# EAGLE design I2C-SignalTestJig (EAGLE 7.7.0)
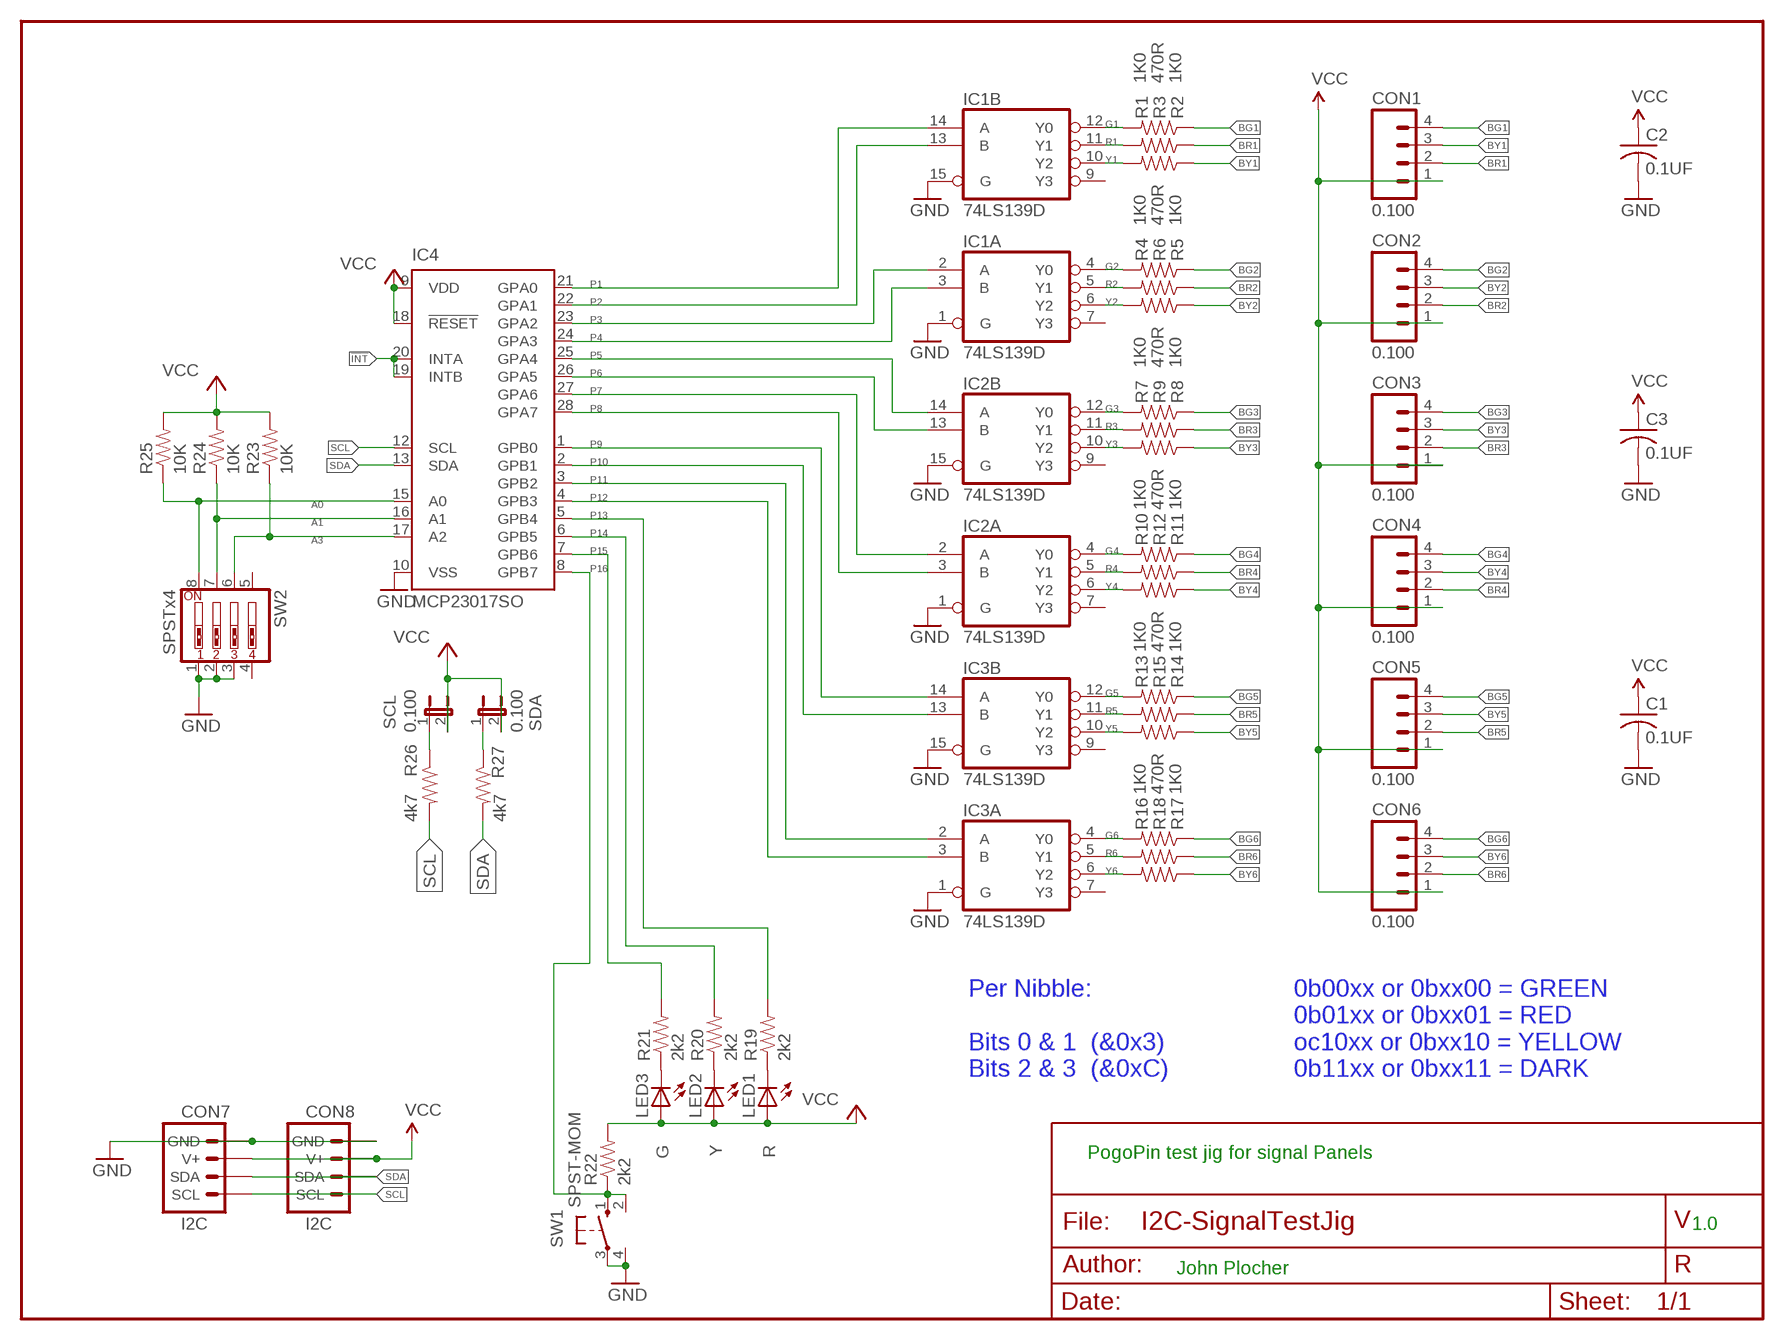
[diagram p0: schematic, sheet 1]

## Parts
C1  0.1UF  CAP0603  [0603-CAP]
C2  0.1UF  CAP0603  [0603-CAP]
C3  0.1UF  CAP0603  [0603-CAP]
CON1  0.100  CONNECTOR-M04LOCK  [1X04_LOCK]
CON2  0.100  CONNECTOR-M04LOCK  [1X04_LOCK]
CON3  0.100  CONNECTOR-M04LOCK  [1X04_LOCK]
CON4  0.100  CONNECTOR-M04LOCK  [1X04_LOCK]
CON5  0.100  CONNECTOR-M04LOCK  [1X04_LOCK]
CON6  0.100  CONNECTOR-M04LOCK  [1X04_LOCK]
CON7  I2C  CONNECTOR-I2CLEFT  [I2C-L]
CON8  I2C  CONNECTOR-I2CLEFT  [I2C-L]
IC1  74LS139D  [SO16]
IC2  74LS139D  [SO16]
IC3  74LS139D  [SO16]
IC4  MCP23017SO  [SO28W]
LED1  R  LED0603-LED  [0603-LED]
LED2  Y  LED0603-LED  [0603-LED]
LED3  G  LED0603-LED  [0603-LED]
R1  1K0  R0805-RES  [0805-RES]
R2  1K0  R0805-RES  [0805-RES]
R3  470R  R0805-RES  [0805-RES]
R4  1K0  R0805-RES  [0805-RES]
R5  1K0  R0805-RES  [0805-RES]
R6  470R  R0805-RES  [0805-RES]
R7  1K0  R0805-RES  [0805-RES]
R8  1K0  R0805-RES  [0805-RES]
R9  470R  R0805-RES  [0805-RES]
R10  1K0  R0805-RES  [0805-RES]
R11  1K0  R0805-RES  [0805-RES]
R12  470R  R0805-RES  [0805-RES]
R13  1K0  R0805-RES  [0805-RES]
R14  1K0  R0805-RES  [0805-RES]
R15  470R  R0805-RES  [0805-RES]
R16  1K0  R0805-RES  [0805-RES]
R17  1K0  R0805-RES  [0805-RES]
R18  470R  R0805-RES  [0805-RES]
R19  2k2  R0603-RES  [0603-RES]
R20  2k2  R0603-RES  [0603-RES]
R21  2k2  R0603-RES  [0603-RES]
R22  2k2  R0603-RES  [0603-RES]
R23  10K  R0603-RES  [0603-RES]
R24  10K  R0603-RES  [0603-RES]
R25  10K  R0603-RES  [0603-RES]
R26  4k7  R0603-RES  [0603-RES]
R27  4k7  R0603-RES  [0603-RES]
SCL  0.100  JUMPER-2PTH_LOCK  [1X02_LOCK]
SDA  0.100  JUMPER-2PTH_LOCK  [1X02_LOCK]
SW1  SPST-MOM  SWITCH-(ON)SMALLPADS  [4P-PTH-6.0X6.0X5.0H]
SW2  SPSTx4  SW_DIP-4  [EDG-04]

## Nets
!INT: IC4.19(INTB) IC4.20(INTA)
A0: IC4.15(A0) R25.1 SW2.8
A1: IC4.16(A1) R24.1 SW2.7
A3: IC4.17(A2) R23.1 SW2.6
BG1: CON1.4 R1.1
BG2: CON2.4 R4.1
BG3: CON3.4 R7.1
BG4: CON4.4 R10.1
BG5: CON5.4 R13.1
BG6: CON6.4 R16.1
BR1: CON1.2 R3.1
BR2: CON2.2 R6.1
BR3: CON3.2 R9.1
BR4: CON4.2 R12.1
BR5: CON5.2 R15.1
BR6: CON6.2 R18.1
BY1: CON1.3 R2.1
BY2: CON2.3 R5.1
BY3: CON3.3 R8.1
BY4: CON4.3 R11.1
BY5: CON5.3 R14.1
BY6: CON6.3 R17.1
G1: IC1.12(B:Y0) R1.2
G2: IC1.4(A:Y0) R4.2
G3: IC2.12(B:Y0) R7.2
G4: IC2.4(A:Y0) R10.2
G5: IC3.12(B:Y0) R13.2
G6: IC3.4(A:Y0) R16.2
GND [Power]: C1.2 C2.2 C3.2 CON7.GND CON7.GND@1(GND) CON8.GND CON8.GND@1(GND) IC1.1(A:G) IC1.15(B:G) IC2.1(A:G) IC2.15(B:G) IC3.1(A:G) IC3.15(B:G) IC4.10(VSS) SW1.3(P) SW1.4(P1) SW2.1 SW2.2 SW2.3
N$3: LED3.C R21.1
N$4: LED2.C R20.1
N$5: LED1.C R19.1
N$20 [signals]: R26.1 SCL.1
N$21 [signals]: R27.1 SDA.1
P1 [signals]: IC1.14(B:A) IC4.21(GPA0)
P2 [signals]: IC1.13(B:B) IC4.22(GPA1)
P3 [signals]: IC1.2(A:A) IC4.23(GPA2)
P4 [signals]: IC1.3(A:B) IC4.24(GPA3)
P5: IC2.14(B:A) IC4.25(GPA4)
P6: IC2.13(B:B) IC4.26(GPA5)
P7: IC2.2(A:A) IC4.27(GPA6)
P8: IC2.3(A:B) IC4.28(GPA7)
P9 [signals]: IC3.14(B:A) IC4.1(GPB0)
P10 [signals]: IC3.13(B:B) IC4.2(GPB1)
P11 [signals]: IC3.2(A:A) IC4.3(GPB2)
P12 [signals]: IC3.3(A:B) IC4.4(GPB3)
P13 [signals]: IC4.5(GPB4) R19.2
P14 [signals]: IC4.6(GPB5) R20.2
P15 [signals]: IC4.7(GPB6) R21.2
P16 [signals]: IC4.8(GPB7) R22.1 SW1.1(S) SW1.2(S1)
R1: IC1.11(B:Y1) R3.2
R2: IC1.5(A:Y1) R6.2
R3: IC2.11(B:Y1) R9.2
R4: IC2.5(A:Y1) R12.2
R5: IC3.11(B:Y1) R15.2
R6: IC3.5(A:Y1) R18.2
SCL [signals]: CON7.SCL CON7.SCL@1(SCL) CON8.SCL CON8.SCL@1(SCL) IC4.12(SCL) R26.2
SDA [signals]: CON7.SDA CON7.SDA@1(SDA) CON8.SDA CON8.SDA@1(SDA) IC4.13(SDA) R27.2
VCC [Power]: C1.1 C2.1 C3.1 CON1.1 CON2.1 CON3.1 CON4.1 CON5.1 CON6.1 CON7.V+ CON7.V+@1(V+) CON8.V+ CON8.V+@1(V+) IC4.9(VDD) IC4.18(!RESET) LED1.A LED2.A LED3.A R22.2 R23.2 R24.2 R25.2 SCL.2 SDA.2
Y1: IC1.10(B:Y2) R2.2
Y2: IC1.6(A:Y2) R5.2
Y3: IC2.10(B:Y2) R8.2
Y4: IC2.6(A:Y2) R11.2
Y5: IC3.10(B:Y2) R14.2
Y6: IC3.6(A:Y2) R17.2
Unconnected: IC1.7(A:Y3) IC1.9(B:Y3) IC2.7(A:Y3) IC2.9(B:Y3) IC3.7(A:Y3) IC3.9(B:Y3) SW2.4 SW2.5

## Notes on the sheet
- Per Nibble:
  
  Bits 0 & 1  (&0x3)
  Bits 2 & 3  (&0xC)
- 0b00xx or 0bxx00 = GREEN
  0b01xx or 0bxx01 = RED
  oc10xx or 0bxx10 = YELLOW
  0b11xx or 0bxx11 = DARK
- PogoPin test jig for signal Panels
- 1.0
- John Plocher

## Power pins joined to a net without a drawn wire
GND: IC1.8(P:GND) IC2.8(P:GND) IC3.8(P:GND)
VCC: IC1.16(P:VCC) IC2.16(P:VCC) IC3.16(P:VCC)

## Library data of the parts
C1-C3 = SPCoast:CAP*
CON1-CON6 = SPCoast:CONNECTOR-M04: Header 4 Standard 4-pin 0.1" header. Use with straight break away headers (SKU : PRT-00116), right angle break away headers (PRT-00553), swiss pins (PRT-00743), machine pins (PRT-00117), and female headers (PRT-00115). Molex polarized connector foot print use with SKU : PRT-08231 with associated crimp pins and housings. 1MM SMD Version SKU: PRT-10208
CON7 CON8 = SPCoast:CONNECTOR-I2C
IC1-IC3 = SPCoast:74*139: Dual 2-line to 4-line DECODER/DEMULTIPLEXER
IC4 = SPCoast:MCP23017: http://ww1.microchip.com/downloads/en/DeviceDoc/21952a.pdf Source: http://ww1.microchip.com/downloads/en/DeviceDoc/21952a.pdf; MF: MICROCHIP; MPN: MCP23017-E/SO; OC_FARNELL: 1332087; OC_NEWARK: 31K2958
LED1-LED3 = SPCoast:LED*
R1-R27 = SPCoast:R*: Resistor Basic schematic elements and footprints for 0603, 1206, and PTH 1/10th watt (small) resistors.
SCL SDA = SPCoast:JUMPER-2: Jumper Basic 0.1" spaced jumper. Use with breakaway headers.
SW1 = SPCoast:SWITCH-(ON): OMRON SWITCH; BEST: TS-1109; OMRON: B3F-10XX; OPL: 3110040P1
SW2 = SPCoast:SW_DIP-4: DIP SWITCH

## Board
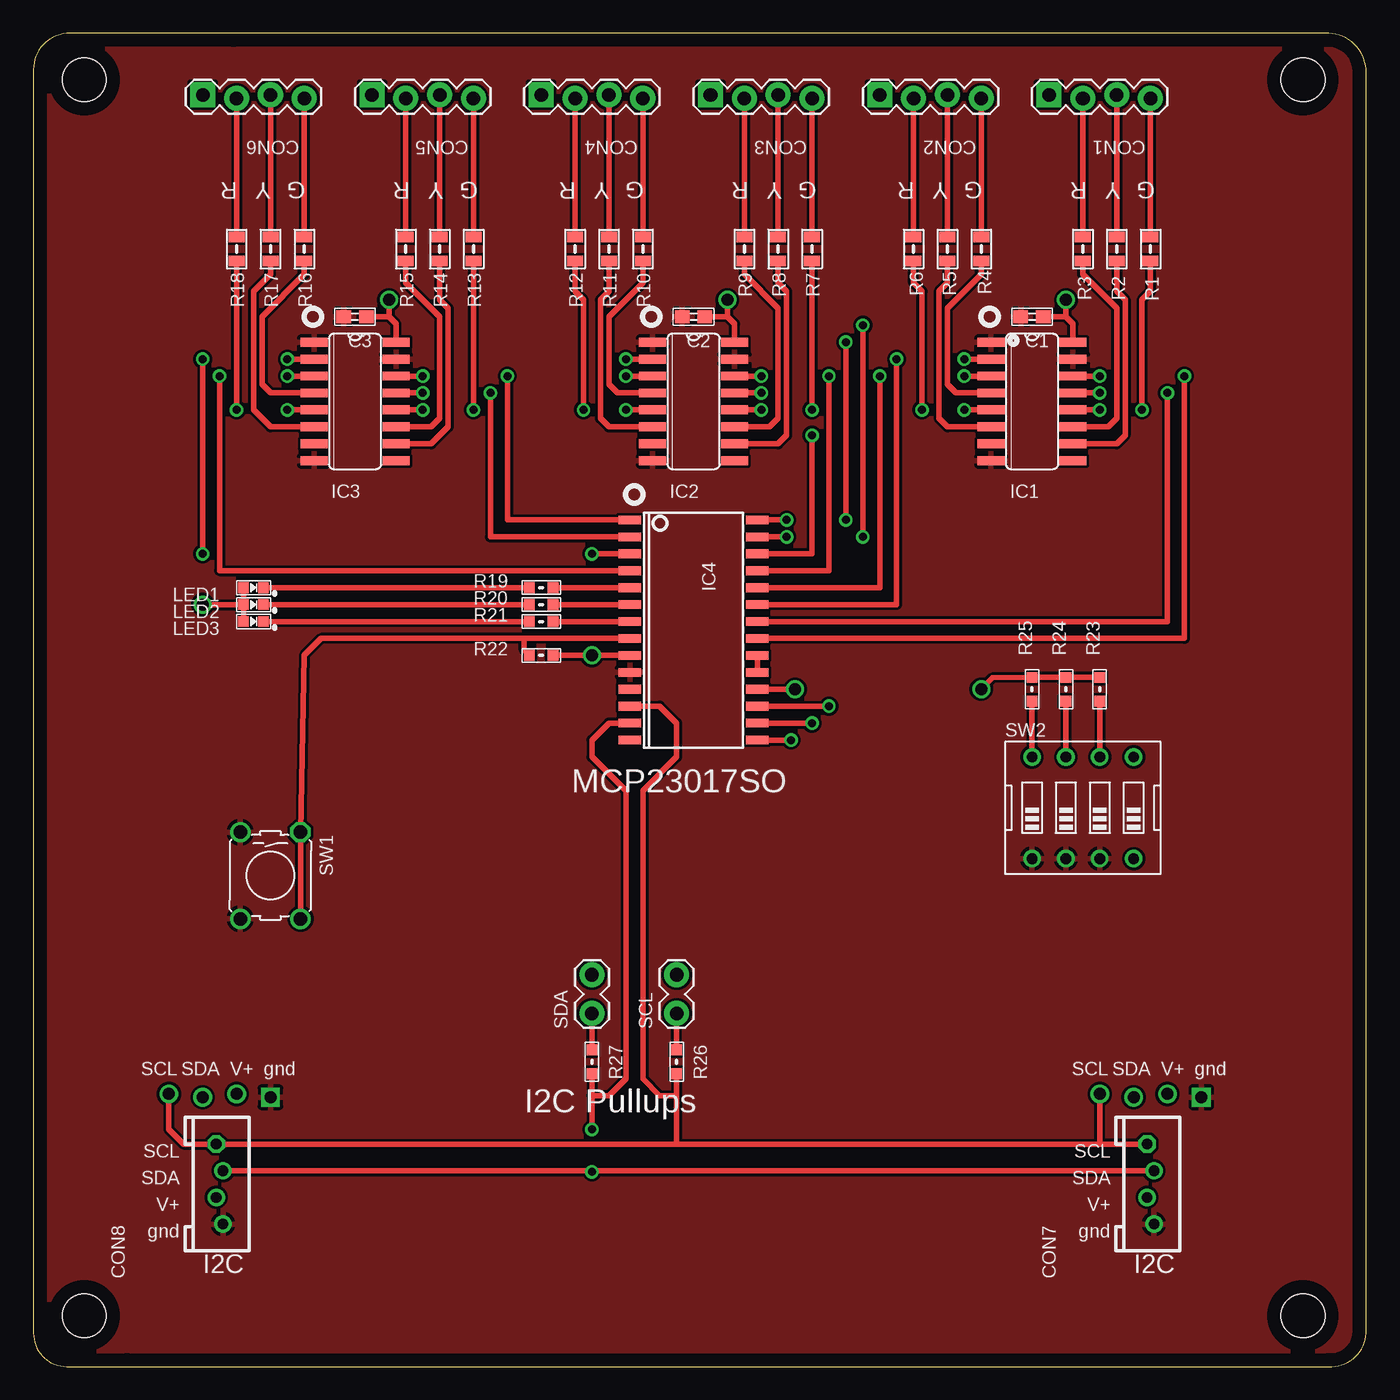
[diagram p1: board, top side]
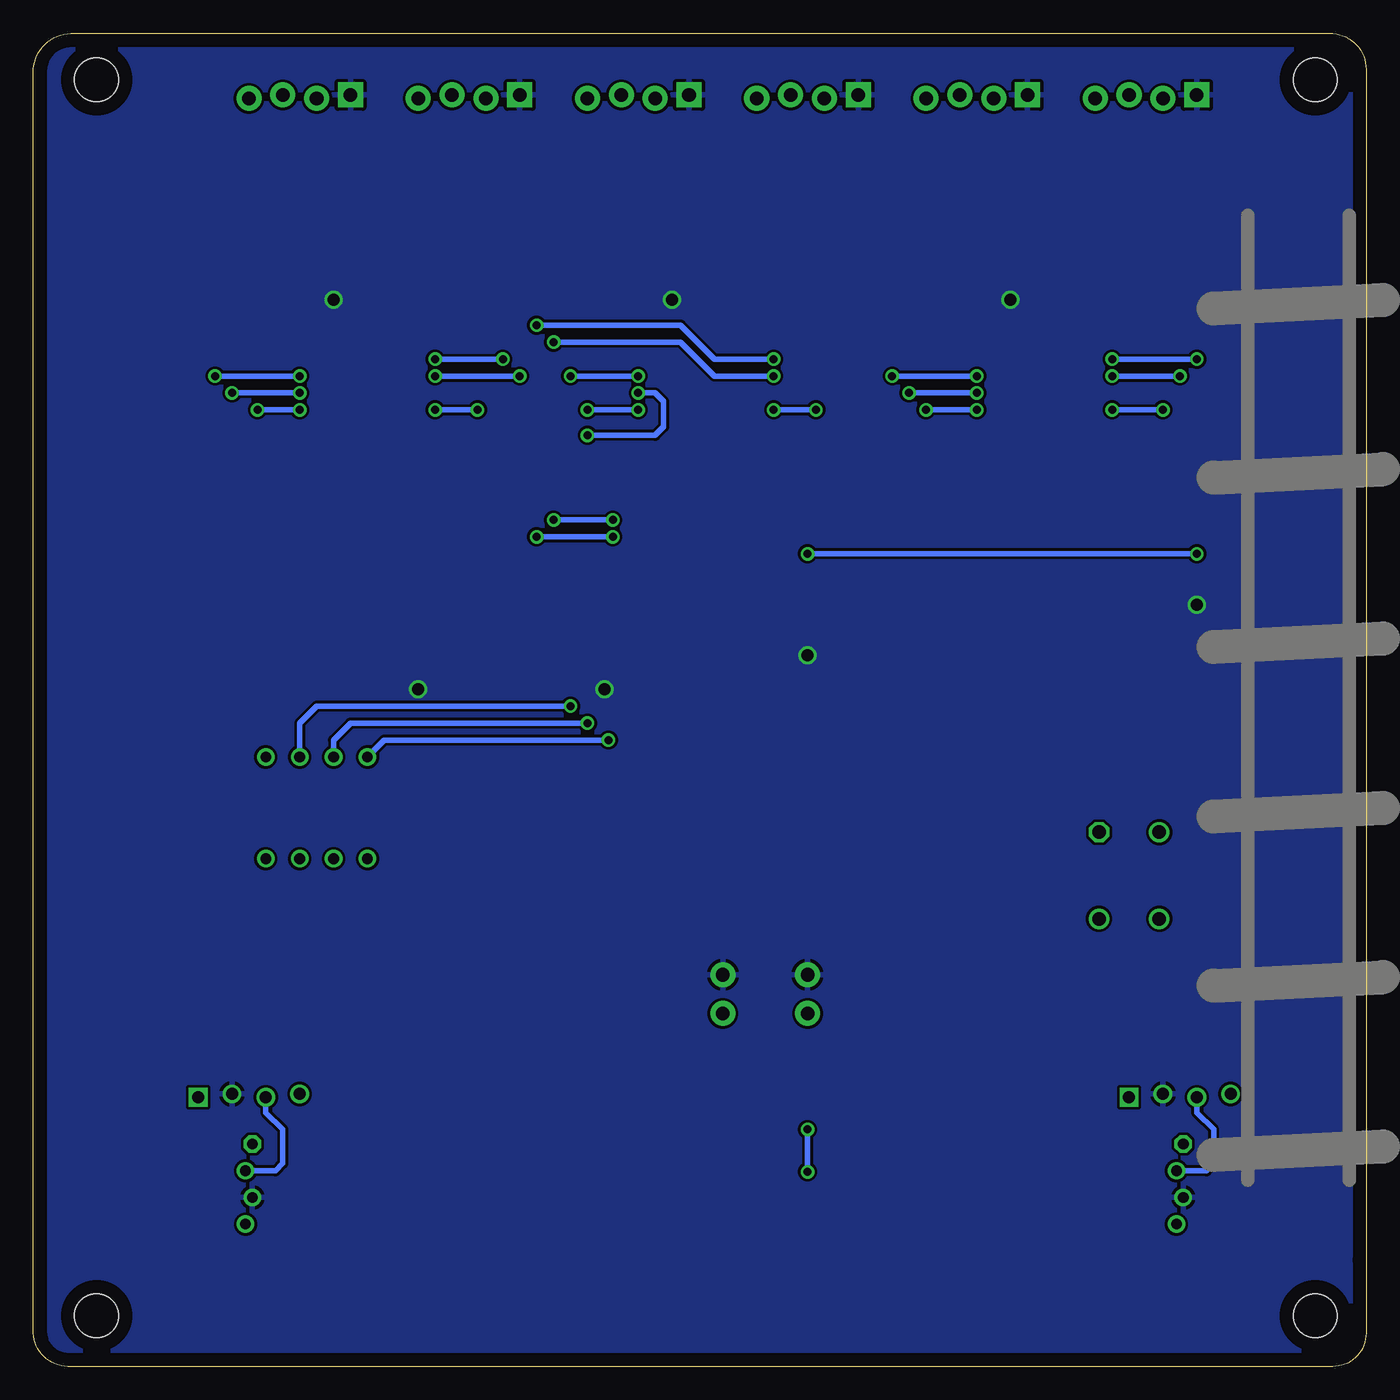
[diagram p2: board, bottom side, seen from below]

Size 100.01 x 100 mm. Coordinates in mm from the lower left corner, seen from the top.
Copper layers (1*16): Top 0.035mm / dielectric 1.5mm / Bottom 0.035mm
Design rules "default *": minimum track width 10mil, minimum drill 0.4mm, track to track 8mil, track to pad 8mil, pad to pad 8mil, via to via 8mil, smd to smd 8mil, copper to edge 40mil, drill to drill 8mil, minimum pad ring 10mil, minimum via ring 8mil, stop-mask expansion 4mil, vias tented up to drill 0mil, thermal gap 10mil
Holes 3.3 mm at 95.26,96.52 3.82,96.52 3.82,3.81 95.26,3.81

### Footprints (pad centres in the part's own frame; a part is rotated, then mirrored left to right if it is on the bottom)
0603-CAP = smd 1.1 x 1: 1 -0.85,0; 2 0.85,0
1X04_LOCK = drill 1.016 pad 1.88 square: 1 0,0.127 | drill 1.016 pad 1.88: 2 2.54,-0.127; 3 5.08,0.127; 4 7.62,-0.127
I2C-L = drill 0.9 square: GND 3.81,-0.127 | drill 0.8 pad 1.27: GND@1 0.254,-9.635; SDA@1 0.254,-5.635; V+@1 -0.254,-7.635 | drill 0.9: SCL -3.81,0.127; SDA -1.27,-0.127; V+ 1.27,0.127 | drill 0.8 pad 1.27 octagon: SCL@1 -0.254,-3.635
SO16 = smd 0.66 x 2.032: 1 -4.445,-3.073; 2 -3.175,-3.073; 3 -1.905,-3.073; 4 -0.635,-3.073; 5 0.635,-3.073; 6 1.905,-3.073; 7 3.175,-3.073; 8 4.445,-3.073; 9 4.445,3.073; 10 3.175,3.073; 11 1.905,3.073; 12 0.635,3.073; 13 -0.635,3.073; 14 -1.905,3.073; 15 -3.175,3.073; 16 -4.445,3.073
SO28W = smd 0.65 x 1.7: 1 -7.62,-4.78; 2 -6.35,-4.78; 3 -5.08,-4.78; 4 -3.81,-4.78; 5 -2.54,-4.78; 6 -1.27,-4.78; 7 0,-4.78; 8 1.27,-4.78; 9 2.54,-4.78; 10 3.81,-4.78; 11 5.08,-4.78; 12 6.35,-4.78; 13 7.62,-4.78; 14 8.89,-4.78; 15 8.89,4.78; 16 7.62,4.78; 17 6.35,4.78; 18 5.08,4.78; 19 3.81,4.78; 20 2.54,4.78; 21 1.27,4.78; 22 0,4.78; 23 -1.27,4.78; 24 -2.54,4.78; 25 -3.81,4.78; 26 -5.08,4.78; 27 -6.35,4.78; 28 -7.62,4.78
0603-LED = smd 0.8 x 0.8: A 0.75,0; C -0.75,0
0805-RES = smd 0.8 x 1.2: 1 -0.9,0; 2 0.9,0
0603-RES = smd 0.813 x 0.813: 1 -0.889,0; 2 0.889,0
1X02_LOCK = drill 1.016 pad 1.88: 1 -0.178,0; 2 2.718,0
4P-PTH-6.0X6.0X5.0H = drill 1.016 octagon: 1 -3.251,2.261 | drill 1.016: 2 3.251,2.261; 3 -3.251,-2.261; 4 3.251,-2.261
EDG-04 = drill 0.813: 1 -3.81,-3.81; 2 -1.27,-3.81; 3 1.27,-3.81; 4 3.81,-3.81; 5 3.81,3.81; 6 1.27,3.81; 7 -1.27,3.81; 8 -3.81,3.81

### Placement (x,y rotation side)
BOARD1  BOARD  [BOARD-SEEED10X10-NOHOLES]  0.01,0 0 top
C1  74.94,78.74 180 top
C2  49.54,78.74 180 top
C3  24.14,78.74 180 top
CON1  76.21,95.25 0 top
CON2  63.51,95.25 0 top
CON3  50.81,95.25 0 top
CON4  38.11,95.25 0 top
CON5  25.41,95.25 0 top
CON6  12.71,95.25 0 top
CON7  83.83,20.32 0 top
CON8  13.98,20.32 0 top
IC1  74.94,72.39 270 top
IC2  49.54,72.39 270 top
IC3  24.14,72.39 270 top
IC4  49.54,55.88 270 top
LED1  16.52,58.42 180 top
LED2  16.52,57.15 180 top
LED3  16.52,55.88 180 top
R1  83.83,83.82 270 top
R2  81.29,83.82 270 top
R3  78.75,83.82 270 top
R4  71.13,83.82 270 top
R5  68.59,83.82 270 top
R6  66.05,83.82 270 top
R7  58.43,83.82 270 top
R8  55.89,83.82 270 top
R9  53.35,83.82 270 top
R10  45.73,83.82 270 top
R11  43.19,83.82 270 top
R12  40.65,83.82 270 top
R13  33.03,83.82 270 top
R14  30.49,83.82 270 top
R15  27.95,83.82 270 top
R16  20.33,83.82 270 top
R17  17.79,83.82 270 top
R18  15.25,83.82 270 top
R19  38.11,58.42 0 top
R20  38.11,57.15 0 top
R21  38.11,55.88 0 top
R22  38.11,53.34 0 top
R23  80.02,50.8 90 top
R24  77.48,50.8 90 top
R25  74.94,50.8 90 top
R26  48.27,22.86 270 top
R27  41.92,22.86 270 top
SCL  48.27,26.67 90 top
SDA  41.92,26.67 90 top
SW1  17.79,36.83 270 top
SW2  78.75,41.91 0 top

### Tracks (layer width: path | path; a pad name or v marks a point on that pad's centre or on a via)
!INT
  Top 0.406: IC4.19 IC4.20
A0  (via drill 0.6)
  Top 0.406: R25.1 SW2.8 | IC4.15 v56.86,46.99
  Bottom 0.406: v56.86,46.99 73.67,46.99 SW2.8
A1  (via drill 0.6)
  Top 0.406: R24.1 SW2.7 | IC4.16 v58.43,48.26
  Bottom 0.406: v58.43,48.26 76.21,48.26 77.48,46.99 SW2.7
A3  (via drill 0.6)
  Top 0.406: R23.1 SW2.6 | IC4.17 v59.7,49.53
  Bottom 0.406: v59.7,49.53 78.75,49.53 80.02,48.26 SW2.6
BG1
  Top 0.406: CON1.4 R1.1
BG2
  Top 0.406: CON2.4 R4.1
BG3
  Top 0.406: CON3.4 R7.1
BG4
  Top 0.406: CON4.4 R10.1
BG5
  Top 0.406: CON5.4 R13.1
BG6
  Top 0.406: CON6.4 R16.1
BR1
  Top 0.406: CON1.2 R3.1
BR2
  Top 0.406: CON2.2 R6.1
BR3
  Top 0.406: CON3.2 R9.1
BR4
  Top 0.406: CON4.2 R12.1
BR5
  Top 0.406: CON5.2 R15.1
BR6
  Top 0.406: CON6.2 R18.1
BY1
  Top 0.406: CON1.3 R2.1
BY2
  Top 0.406: CON2.3 R5.1
BY3
  Top 0.406: CON3.3 R8.1
BY4
  Top 0.406: CON4.3 R11.1
BY5
  Top 0.406: CON5.3 R14.1
BY6
  Top 0.406: CON6.3 R17.1
G1  (via drill 0.6)
  Top 0.406: R1.2 83.83,80.65 83.19,80.01 v83.19,71.76 | IC1.12 v80.02,71.76
  Bottom 0.406: v80.02,71.76 v83.19,71.76
G2
  Top 0.406: IC1.4 69.22,73.03 68.59,73.66 68.59,79.38 71.13,81.92 R4.2
G3  (via drill 0.6)
  Top 0.406: R7.2 v58.43,71.76 | v54.62,71.76 IC2.12
  Bottom 0.406: v58.43,71.76 v54.62,71.76
G4
  Top 0.406: R10.2 45.73,81.28 43.19,78.74 43.19,73.66 43.82,73.03 IC2.4
G5  (via drill 0.6)
  Top 0.406: IC3.12 v29.22,71.76 | v33.03,71.76 R13.2
  Bottom 0.406: v29.22,71.76 v33.03,71.76
G6
  Top 0.406: R16.2 20.33,81.92 17.15,78.74 17.15,73.66 17.79,73.03 IC3.4
GND
  pour Top: 99.07,100.33 99.07,0 -1.26,0 -1.26,100.33
N$3
  Top 0.406: R21.1 LED3.C
N$4
  Top 0.406: R20.1 LED2.C
N$5
  Top 0.406: R19.1 LED1.C
N$20
  Top 0.406: R26.1 SCL.1
N$21
  Top 0.406: R27.1 SDA.1
P1  (via drill 0.6)
  Top 0.406: IC1.14 v80.02,74.3 | v86.37,74.3 86.37,54.61 IC4.21
  Bottom 0.406: v80.02,74.3 v86.37,74.3
P2  (via drill 0.6)
  Top 0.406: IC1.13 v80.02,73.03 | v85.1,73.03 85.1,55.88 IC4.22
  Bottom 0.406: v80.02,73.03 v85.1,73.03
P3  (via drill 0.6)
  Top 0.406: IC1.2 v69.86,75.57 | v64.78,75.57 64.78,57.15 IC4.23
  Bottom 0.406: v69.86,75.57 v64.78,75.57
P4  (via drill 0.6)
  Top 0.406: IC1.3 v69.86,74.3 | v63.51,74.3 63.51,58.42 IC4.24
  Bottom 0.406: v69.86,74.3 v63.51,74.3
P5  (via drill 0.6)
  Top 0.406: IC2.14 v54.62,74.3 | v59.7,74.3 59.7,59.69 IC4.25
  Bottom 0.406: v54.62,74.3 v59.7,74.3
P6  (via drill 0.6)
  Top 0.406: IC2.13 v54.62,73.03 | v58.43,69.85 58.43,60.96 IC4.26
  Bottom 0.406: v54.62,73.03 53.35,73.03 52.71,72.39 52.71,70.49 53.35,69.85 v58.43,69.85
P7  (via drill 0.6)
  Top 0.406: IC2.2 v44.46,75.57 | v62.24,78.11 v62.24,62.23 | v56.52,62.23 IC4.27
  Bottom 0.406: v44.46,75.57 48.9,75.57 51.44,78.11 v62.24,78.11 | v62.24,62.23 v56.52,62.23
P8  (via drill 0.6)
  Top 0.406: IC2.3 v44.46,74.3 | v60.97,76.84 v60.97,63.5 | v56.52,63.5 IC4.28
  Bottom 0.406: v44.46,74.3 48.9,74.3 51.44,76.84 v60.97,76.84 | v60.97,63.5 v56.52,63.5
P9  (via drill 0.6)
  Top 0.406: IC3.14 v29.22,74.3 | v35.57,74.3 35.57,63.5 IC4.1
  Bottom 0.406: v29.22,74.3 v35.57,74.3
P10  (via drill 0.6)
  Top 0.406: IC3.13 v29.22,73.03 | v34.3,73.03 34.3,62.23 IC4.2
  Bottom 0.406: v29.22,73.03 v34.3,73.03
P11  (via drill 0.6)
  Top 0.406: IC3.2 v19.06,75.57 | v12.71,75.57 v12.71,60.96 | v41.92,60.96 IC4.3
  Bottom 0.406: v19.06,75.57 v12.71,75.57 | v12.71,60.96 v41.92,60.96
P12  (via drill 0.6)
  Top 0.406: IC3.3 v19.06,74.3 | v13.98,74.3 13.98,59.69 IC4.4
  Bottom 0.406: v19.06,74.3 v13.98,74.3
P13
  Top 0.406: R19.2 IC4.5
P14
  Top 0.406: R20.2 IC4.6
P15
  Top 0.406: R21.2 IC4.7
P16
  Top 0.406: IC4.8 36.84,54.61 | 36.84,54.61 21.6,54.61 20.33,53.34 SW1.1 SW1.2 | R22.1 36.84,53.76 36.84,54.61
R1
  Top 0.406: IC1.11 80.65,70.49 81.29,71.12 81.29,79.38 78.75,81.92 R3.2
R2  (via drill 0.6)
  Top 0.406: IC1.5 v69.86,71.76 | v66.68,71.76 66.68,80.65 66.05,81.28 R6.2
  Bottom 0.406: v69.86,71.76 v66.68,71.76
R3
  Top 0.406: R9.2 53.35,81.92 55.89,79.38 55.89,71.12 55.25,70.49 IC2.11
R4  (via drill 0.6)
  Top 0.406: IC2.5 v44.46,71.76 | v41.28,71.76 41.28,80.01 40.65,80.65 R12.2
  Bottom 0.406: v44.46,71.76 v41.28,71.76
R5
  Top 0.406: R15.2 27.95,81.28 30.49,78.74 30.49,71.12 29.85,70.49 IC3.11
R6  (via drill 0.6)
  Top 0.406: IC3.5 v19.06,71.76 | v15.25,71.76 R18.2
  Bottom 0.406: v19.06,71.76 v15.25,71.76
SCL
  Top 0.406: CON8.SCL 10.17,17.78 11.26,16.69 CON8.SCL@1 48.27,16.69 | CON7.SCL@1 80.02,16.69 | 80.02,16.69 CON7.SCL | 48.27,16.69 80.02,16.69 | R26.2 48.27,20.32 | 48.27,20.32 48.27,16.69 | IC4.12 47,49.53 48.27,48.26 48.27,45.72 45.73,43.18 45.73,21.59 47,20.32 48.27,20.32
SDA  (via drill 0.6)
  Top 0.406: CON8.SDA@1 41.92,14.69 | 41.92,14.69 CON7.SDA@1 | R27.2 41.92,20.32 | 41.92,20.32 v41.92,17.78 | v41.92,14.61 41.92,14.69 | IC4.13 43.19,48.26 41.92,46.99 41.92,45.72 44.46,43.18 44.46,21.59 43.19,20.32 41.92,20.32
  Bottom 0.406: CON7.SDA 82.56,19.05 81.29,17.78 81.29,15.24 81.84,14.69 CON7.SDA@1 | CON8.SDA 12.71,19.05 11.44,17.78 11.44,15.24 11.99,14.69 CON8.SDA@1 | v41.92,17.78 v41.92,14.61
VCC  (via drill 0.9)
  Top 0.406: IC1.16 78.01,78.21 77.48,78.74 | 77.48,78.74 C1.1 | v77.48,80.01 77.48,78.74 | IC2.16 52.61,78.21 52.08,78.74 | 52.08,78.74 C2.1 | IC3.16 27.21,78.21 26.68,78.74 | 26.68,78.74 C3.1 | v26.68,80.01 26.68,78.74 | v52.08,80.01 52.08,78.74 | IC4.9 v41.92,53.34 R22.2 | LED3.A LED2.A | LED2.A LED1.A | v12.71,57.15 LED2.A | IC4.18 v57.16,50.8 | R23.2 R24.2 R25.2 71.98,51.65 v71.13,50.8
  pour Bottom: 99.07,100.33 99.07,0 -1.26,0 -1.26,100.33
Y1
  Top 0.406: R2.2 81.29,80.65 81.92,80.01 81.92,69.85 81.29,69.22 IC1.10
Y2
  Top 0.406: R5.2 68.59,81.28 67.95,80.65 67.95,71.12 68.59,70.49 IC1.6
Y3
  Top 0.406: R8.2 55.89,81.28 56.52,80.65 56.52,69.85 55.89,69.22 IC2.10
Y4
  Top 0.406: R11.2 43.19,80.65 42.55,80.01 42.55,71.12 43.19,70.49 IC2.6
Y5
  Top 0.406: R14.2 30.49,80.01 31.12,79.38 31.12,70.49 29.85,69.22 IC3.10
Y6
  Top 0.406: IC3.6 17.79,70.49 16.52,71.76 16.52,80.65 17.79,81.92 R17.2

### Text on the board
tPlace: R | Y | G | R | Y | G | R | Y | G | R | Y | G | R | Y | G | R | Y | G | I2C Pullups
tDocu: v1.0 | Test Jig: Signal Mast Panel | John Plocher - SPCoast.com
bDocu: Model Railroading is Fun! | Made in the PCR, Coast Division, NMRA